# EAGLE design Rear _light_via (EAGLE 9.0.0)
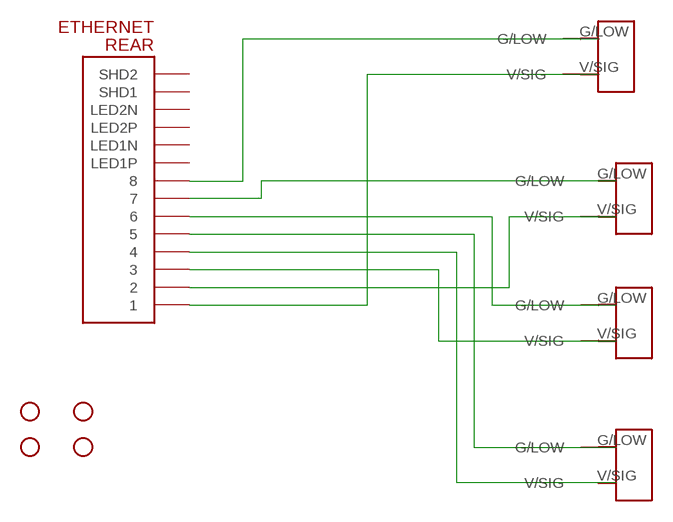
[diagram p0: schematic, sheet 1]

## Parts
H1  STAND-OFF  [STAND-OFF]
H2  STAND-OFF  [STAND-OFF]
H3  STAND-OFF  [STAND-OFF]
H4  STAND-OFF  [STAND-OFF]
REAR  ETHERNET  [A122645-ND]
U$1  2_PIN_TECONNECTOR  [2_PIN_CONNECT]
U$2  2_PIN_TECONNECTOR  [2_PIN_CONNECT]
U$3  2_PIN_TECONNECTOR  [2_PIN_CONNECT]
U$4  2_PIN_TECONNECTOR  [2_PIN_CONNECT]

## Nets
N$1: REAR.P$8 U$1.G/LOW
N$2: REAR.P$7 U$2.G/LOW
N$3: REAR.P$6 U$3.G/LOW
N$4: REAR.P$5 U$4.G/LOW
N$5: REAR.P$4 U$4.V/SIG
N$6: REAR.P$3 U$3.V/SIG
N$7: REAR.P$2 U$2.V/SIG
N$8: REAR.P$1 U$1.V/SIG
Unconnected: REAR.P$9(LED1N) REAR.P$10(LED1P) REAR.P$11(LED2N) REAR.P$12(LED2P) REAR.P$13(SHD1) REAR.P$14(SHD2)

## Library data of the parts
H1-H4 = SparkFun-Electromechanical:STAND-OFF: #4 Stand Off This is the mechanical footprint for a #4 phillips button head screw. Use the keepout ring to avoid running the screw head into surrounding components. SKU : PRT-00447
REAR = ETHERNET:ETHERNET: Ethernet port with 2 leds. digikey number A122645-ND
U$1-U$4 = TE 2-pin connector:2_PIN_TECONNECTOR: 2-pin connector for high power connections on board

## Board
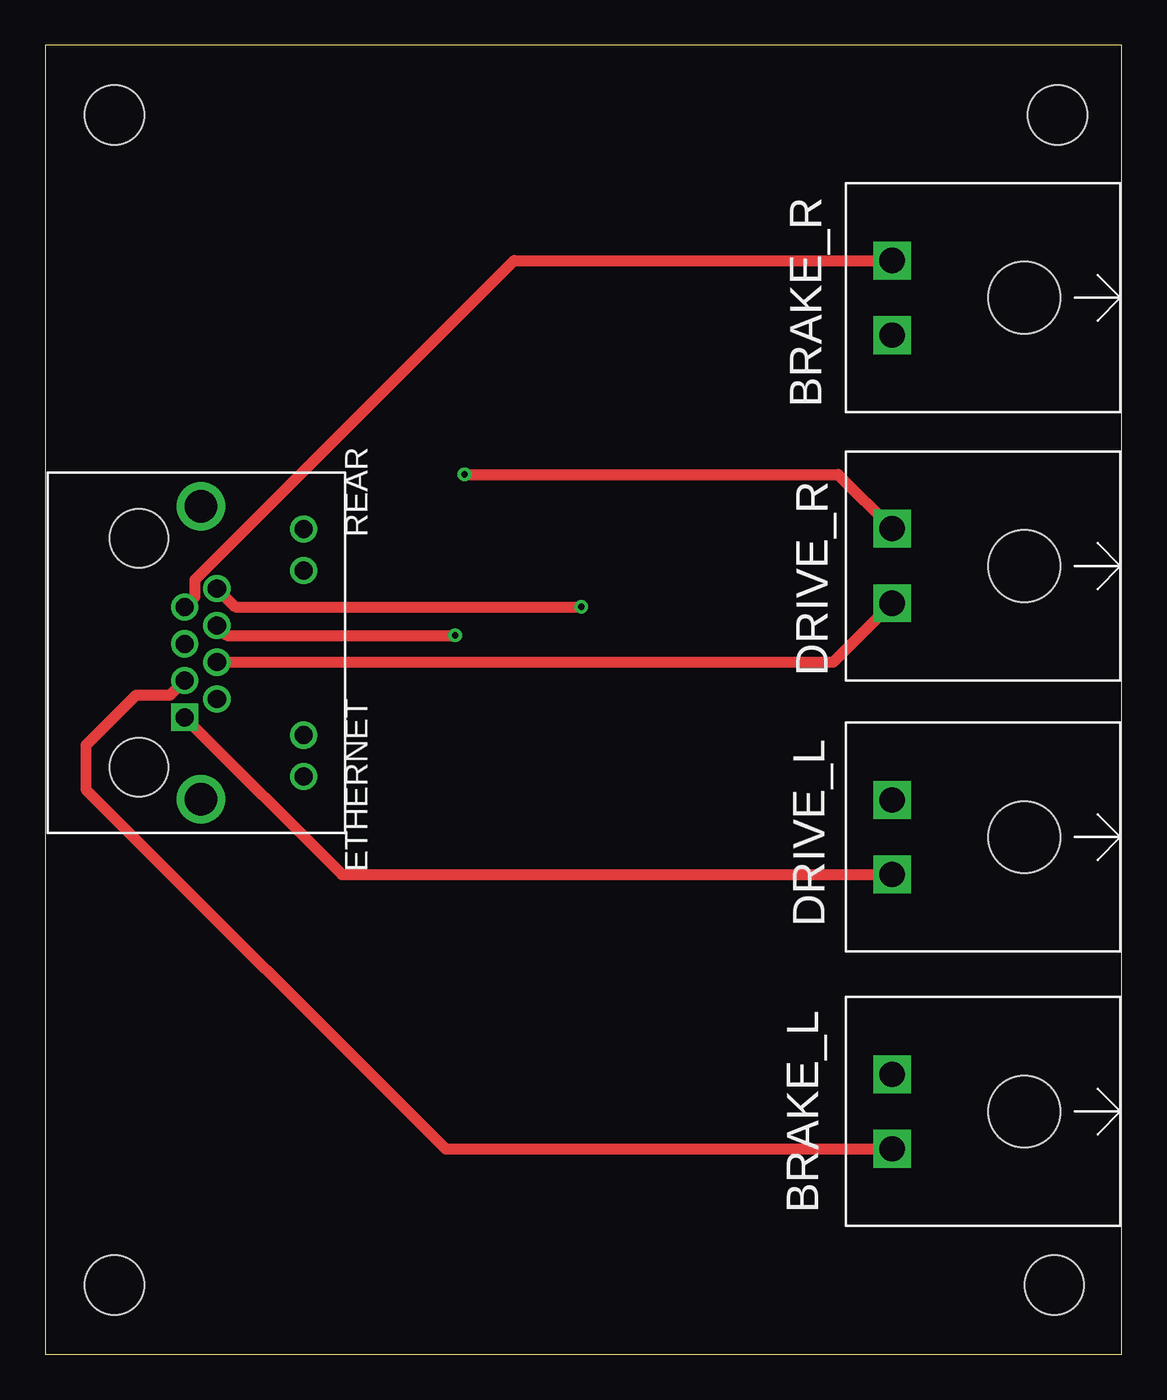
[diagram p1: board, top side]
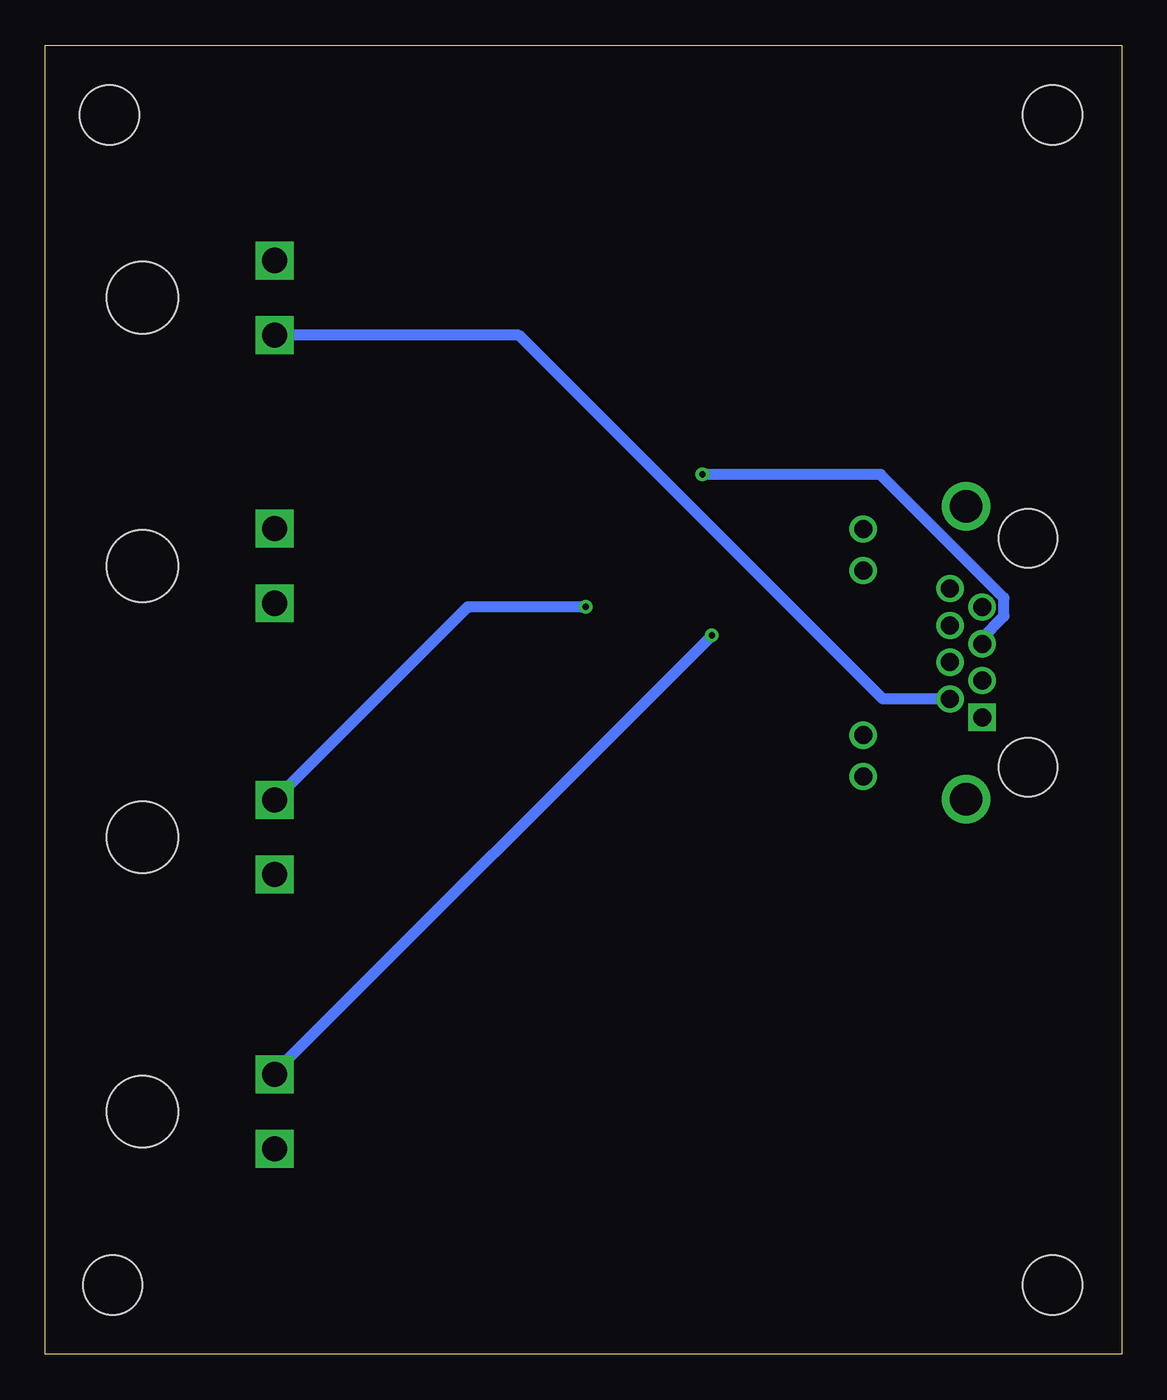
[diagram p2: board, bottom side, seen from below]

Size 59.75 x 72.65 mm. Coordinates in mm from the lower left corner, seen from the top.
Outline: 0,0 59.75,0 59.75,72.65 0,72.65 0,0
Copper layers (1*16): Top 0.035mm / dielectric 1.5mm / Bottom 0.035mm
Design rules "default": minimum track width 6mil, minimum drill 0.35mm, track to track 6mil, track to pad 6mil, pad to pad 6mil, via to via 6mil, smd to smd 6mil, copper to edge 40mil, drill to drill 6mil, minimum pad ring 10mil, minimum via ring 8mil, stop-mask expansion 4mil, vias tented up to drill 0mil, thermal gap 10mil

### Footprints (pad centres in the part's own frame; a part is rotated, then mirrored left to right if it is on the bottom)
STAND-OFF = hole 3.302: 0,0
A122645-ND = drill 1 square: P$1 3.58,2.54 | drill 1: P$2 2.56,4.32; P$3 1.54,2.54; P$4 0.52,4.32; P$5 -0.5,2.54; P$6 -1.52,4.32; P$7 -2.54,2.54; P$8 -3.56,4.32; P$9 -6.86,9.14; P$10 -4.57,9.14; P$11 4.57,9.14; P$12 6.86,9.14 | drill 1.8: P$13 -8.13,3.43; P$14 8.13,3.43 | hole 3.25: -6.35,0; 6.35,0
2_PIN_CONNECT = drill 1.4 square: G/LOW 2.07,12.67; V/SIG -2.07,12.67 | hole 4: 0,5.33

### Placement (x,y rotation side)
H1  3.85,3.85 0 top
H2  56,3.85 0 top
H3  3.85,68.78 0 top
H4  56.17,68.78 0 top
REAR  5.21,38.93 270 top
U$1  59.67,28.7 90 top
U$2  59.67,58.62 90 top
U$3  59.67,13.47 90 top
U$4  59.67,43.75 90 top

### Tracks (layer width: path | path; a pad name or v marks a point on that pad's centre or on a via)
N$1  (via drill 0.35)
  Top 0.61: REAR.P$8 10.55,41.48 v29.75,41.48
  Bottom 0.61: v29.75,41.48 36.3,41.48 U$1.G/LOW
N$2
  Top 0.61: REAR.P$7 8.32,42.04 8.32,42.99 26.03,60.7 U$2.G/LOW
N$3  (via drill 0.35)
  Top 0.61: REAR.P$6 10.09,39.9 v22.75,39.9
  Bottom 0.61: v22.75,39.9 47.01,15.64 U$3.G/LOW
N$4  (via drill 0.35)
  Top 0.61: v23.27,48.83 44,48.83 U$4.G/LOW
  Bottom 0.61: REAR.P$5 7.75,39.76 6.54,40.97 6.54,41.97 13.4,48.83 v23.27,48.83
N$5
  Top 0.61: REAR.P$4 43.73,38.41 U$4.V/SIG
N$6
  Top 0.61: REAR.P$3 6.93,36.56 5.03,36.56 2.27,33.8 2.27,31.36 22.22,11.4 U$3.V/SIG
N$7
  Bottom 0.61: REAR.P$2 13.27,36.37 33.45,56.55 U$2.V/SIG
N$8
  Top 0.61: REAR.P$1 16.48,26.63 U$1.V/SIG

### Text on the board
tNames: BRAKE_R | DRIVE_R | DRIVE_L | BRAKE_L